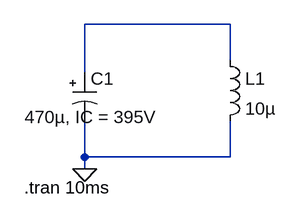
[diagram p0: schematic 75.2u.asc]
75.2u.asc, the LTspice schematic file:
Version 4
SHEET 1 880 680
WIRE 272 64 80 64
WIRE 272 112 272 64
WIRE 80 128 80 64
WIRE 80 240 80 192
WIRE 272 240 272 192
WIRE 272 240 80 240
WIRE 80 256 80 240
FLAG 80 256 0
SYMBOL polcap 64 128 R0
WINDOW 3 -63 59 Left 2
SYMATTR InstName C1
SYMATTR Value 470µ, IC = 395V
SYMATTR Description Capacitor
SYMATTR Type cap
SYMATTR SpiceLine V=450 Irms=1.94 Rser=0.086 Lser=8n mfg="Würth Elektronik" pn="861141485033 WCAP-AI3H 30x40" type="Al electrolytic"
SYMBOL ind 256 96 R0
SYMATTR InstName L1
SYMATTR Value 10µ
TEXT 0 280 Left 2 !.tran 10ms

The netlist it stands for:
* 75.2u.asc
C1 N001 0 470µ, IC = 395V V=450 Irms=1.94 Rser=0.086 Lser=8n mfg="Würth Elektronik" pn="861141485033 WCAP-AI3H 30x40" type="Al electrolytic"
L1 N001 0 10µ
.tran 10ms
.backanno
.end